# EAGLE design hand-made-board (EAGLE 9.5.2)
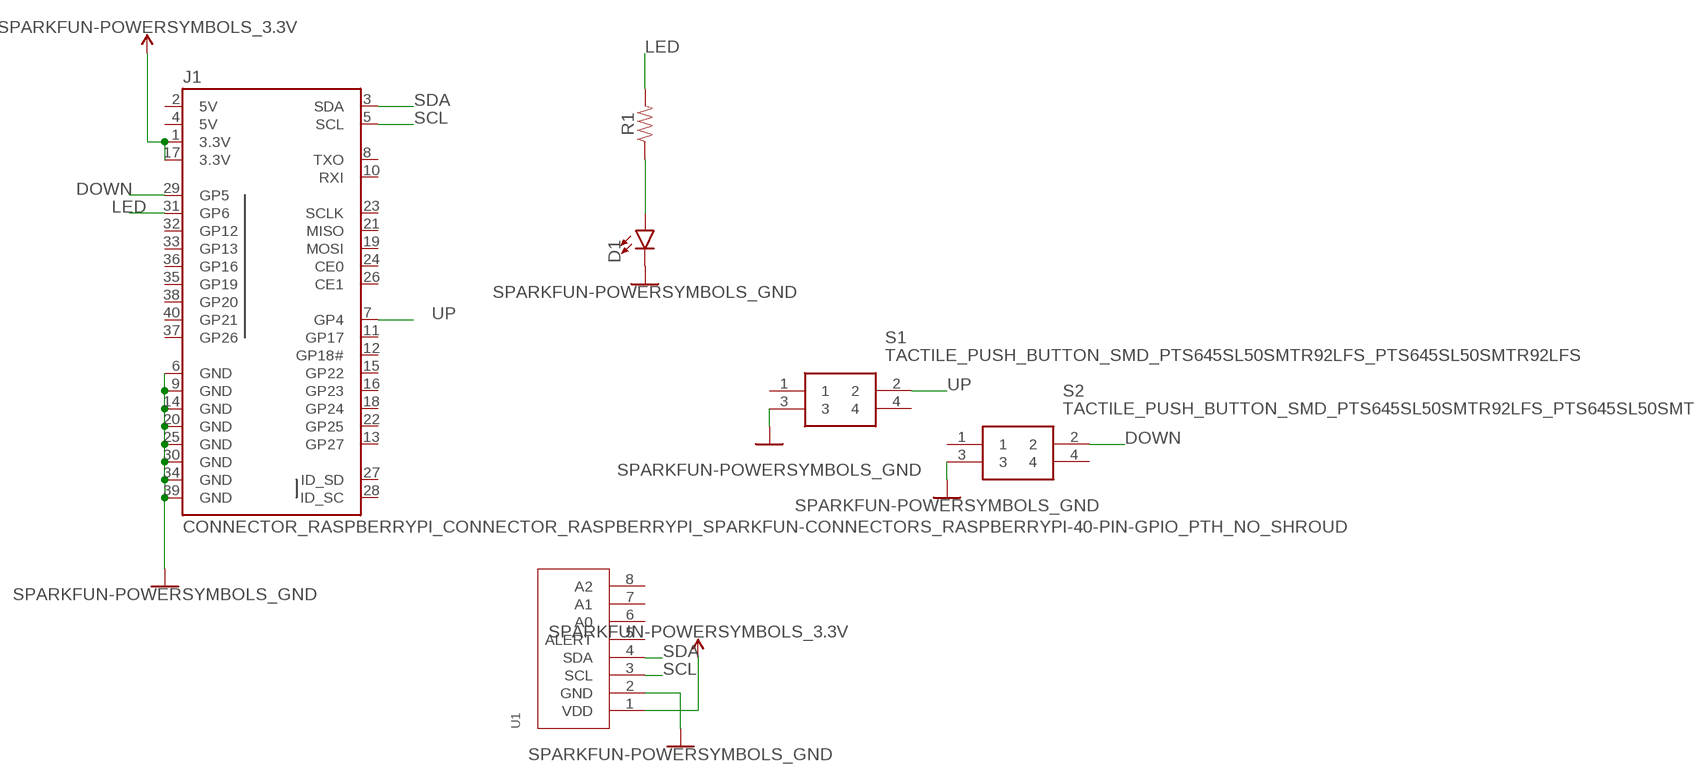
[diagram p0: schematic, sheet 1]

## Parts
D1  LED_SMD_SPARKFUN-LED_LED1206  [LED_SMD_SPARKFUN-LED_LED-1206]
J1  CONNECTOR_RASPBERRYPI_CONNECTOR_RASPBERRYPI_SPARKFUN-CONNECTORS_RASPBERRYPI-40-PIN-GPIO_PTH_NO_SHROUD  [CONNECTOR_RASPBERRYPI_CONNECTOR_RASPBERRYPI_SPARKFUN-CONNECTORS_2X20]
R1  LED_SMD_SPARKFUN-RESISTORS_RESISTOR1206  [LED_SMD_SPARKFUN-RESISTORS_1206]
S1  TACTILE_PUSH_BUTTON_SMD_PTS645SL50SMTR92LFS_PTS645SL50SMTR92LFS  [TACTILE_PUSH_BUTTON_SMD_PTS645SL50SMTR92LFS_PTS645SMT]
S2  TACTILE_PUSH_BUTTON_SMD_PTS645SL50SMTR92LFS_PTS645SL50SMTR92LFS  [TACTILE_PUSH_BUTTON_SMD_PTS645SL50SMTR92LFS_PTS645SMT]
U1  TEMPERATURE_SENSOR_MCP9808  [TEMPERATURE_SENSOR_MCP9808]

## Nets
3.3V: J1.1(3.3V) J1.17(3.3V) U1.1(VDD) ; supply symbol labelled SPARKFUN-POWERSYMBOLS_3.3V
DOWN: J1.29(GP5) S2.2
GND: D1.C J1.6(GND) J1.9(GND) J1.14(GND) J1.20(GND) J1.25(GND) J1.30(GND) J1.34(GND) J1.39(GND) S1.3 S2.3 U1.2(GND) ; supply symbol labelled SPARKFUN-POWERSYMBOLS_GND
LED: J1.31(GP6) R1.2
N$1: D1.A R1.1
SCL: J1.5(SCL) U1.3(SCL)
SDA: J1.3(SDA) U1.4(SDA)
UP: J1.7(GP4) S1.2
Unconnected: J1.8(TXO) J1.10(RXI) J1.11(GP17) J1.12(GP18#) J1.13(GP27) J1.15(GP22) J1.16(GP23) J1.18(GP24) J1.19(MOSI) J1.21(MISO) J1.22(GP25) J1.23(SCLK) J1.24(CE0) J1.26(CE1) J1.27(ID_SD) J1.28(ID_SC) J1.32(GP12) J1.33(GP13) J1.35(GP19) J1.36(GP16) J1.37(GP26) J1.38(GP20) J1.40(GP21) S1.1 S1.4 S2.1 S2.4 U1.5(ALERT) U1.6(A0) U1.7(A1) U1.8(A2)

## Power pins joined to a net without a drawn wire
5V: J1.2(5V) J1.4(5V)

## Library data of the parts
D1 = tempControllerParts:LED_SMD_SPARKFUN-LED_LED: LED (Generic) Standard schematic elements and footprints for 5mm, 3mm, 1206, and 0603 sized LEDs. Generic LEDs with no color specified.; PROD_ID: DIO-08794
J1 = tempControllerParts:CONNECTOR_RASPBERRYPI_CONNECTOR_RASPBERRYPI_SPARKFUN-CONNECTORS_RASPBERRYPI-40-PIN-GPIO: Raspberry Pi GPIO Header 2x20 pin connector, as found on B, B+, A+ models. Both shrouded PTH and SMT versions available. SparkFun Products: GPIO Shrouded Header <https://www.sparkfun.com/products/13054>- PTH SparkFun Pi Wedge (Preassembled) <https://www.sparkfun.com/products/13717>; PROD_ID: CONN-13143; SF_ID: PRT-13054
R1 = tempControllerParts:LED_SMD_SPARKFUN-RESISTORS_RESISTOR: Generic Resistor Package
S1 S2 = tempControllerParts:TACTILE_PUSH_BUTTON_SMD_PTS645SL50SMTR92LFS_PTS645SL50SMTR92LFS: PTS645SL50SMTR92LFS (Tactile Switches) Source: Datasheet <https://www.ckswitches.com/media/1471/pts645.pdf>; DESCRIPTION: PTS645SL50SMTR92LFS (Tactile Switches); HEIGHT: mm; MANUFACTURER_NAME: C & K COMPONENTS; MANUFACTURER_PART_NUMBER: PTS645SL50SMTR92LFS; MOUSER_PART_NUMBER: 611-PTS645SL50SMTR92; MOUSER_PRICE-STOCK: https://www.mouser.com/Search/Refine.aspx?Keyword=611-PTS645SL50SMTR92
U1 = tempControllerParts:TEMPERATURE_SENSOR_MCP9808

## Board
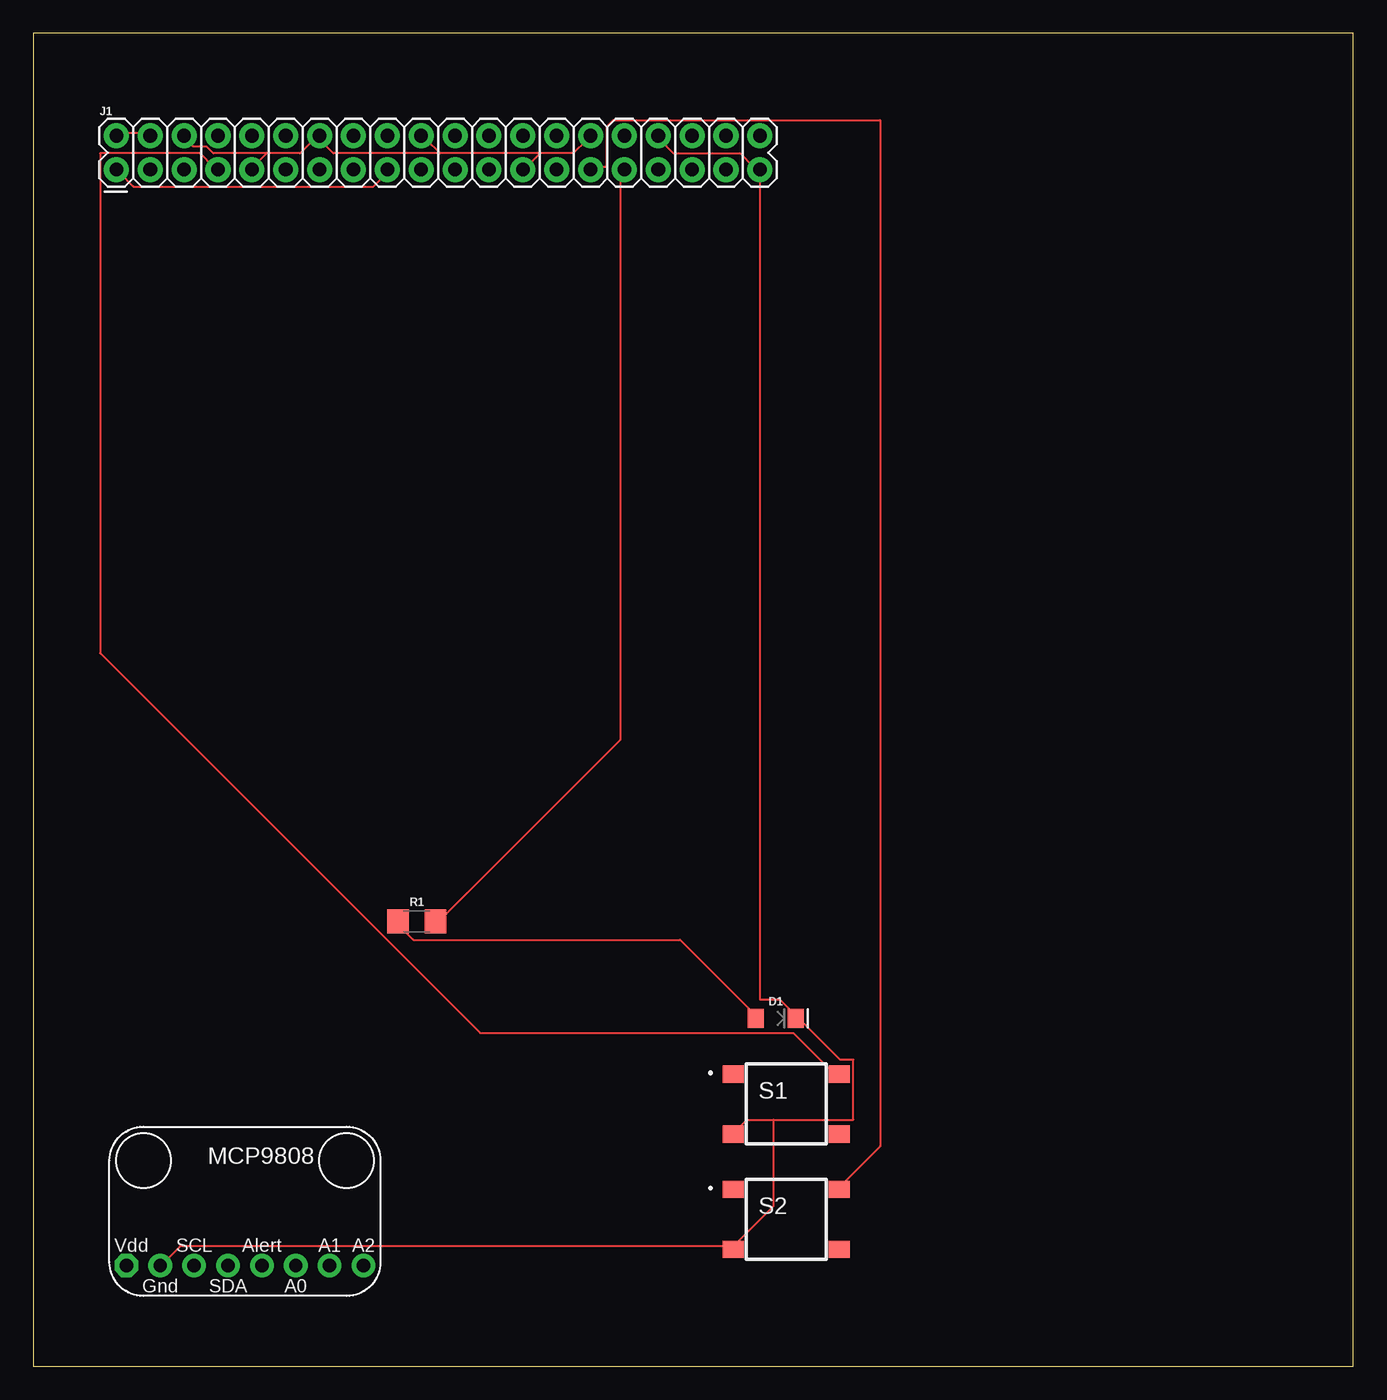
[diagram p1: board, top side]
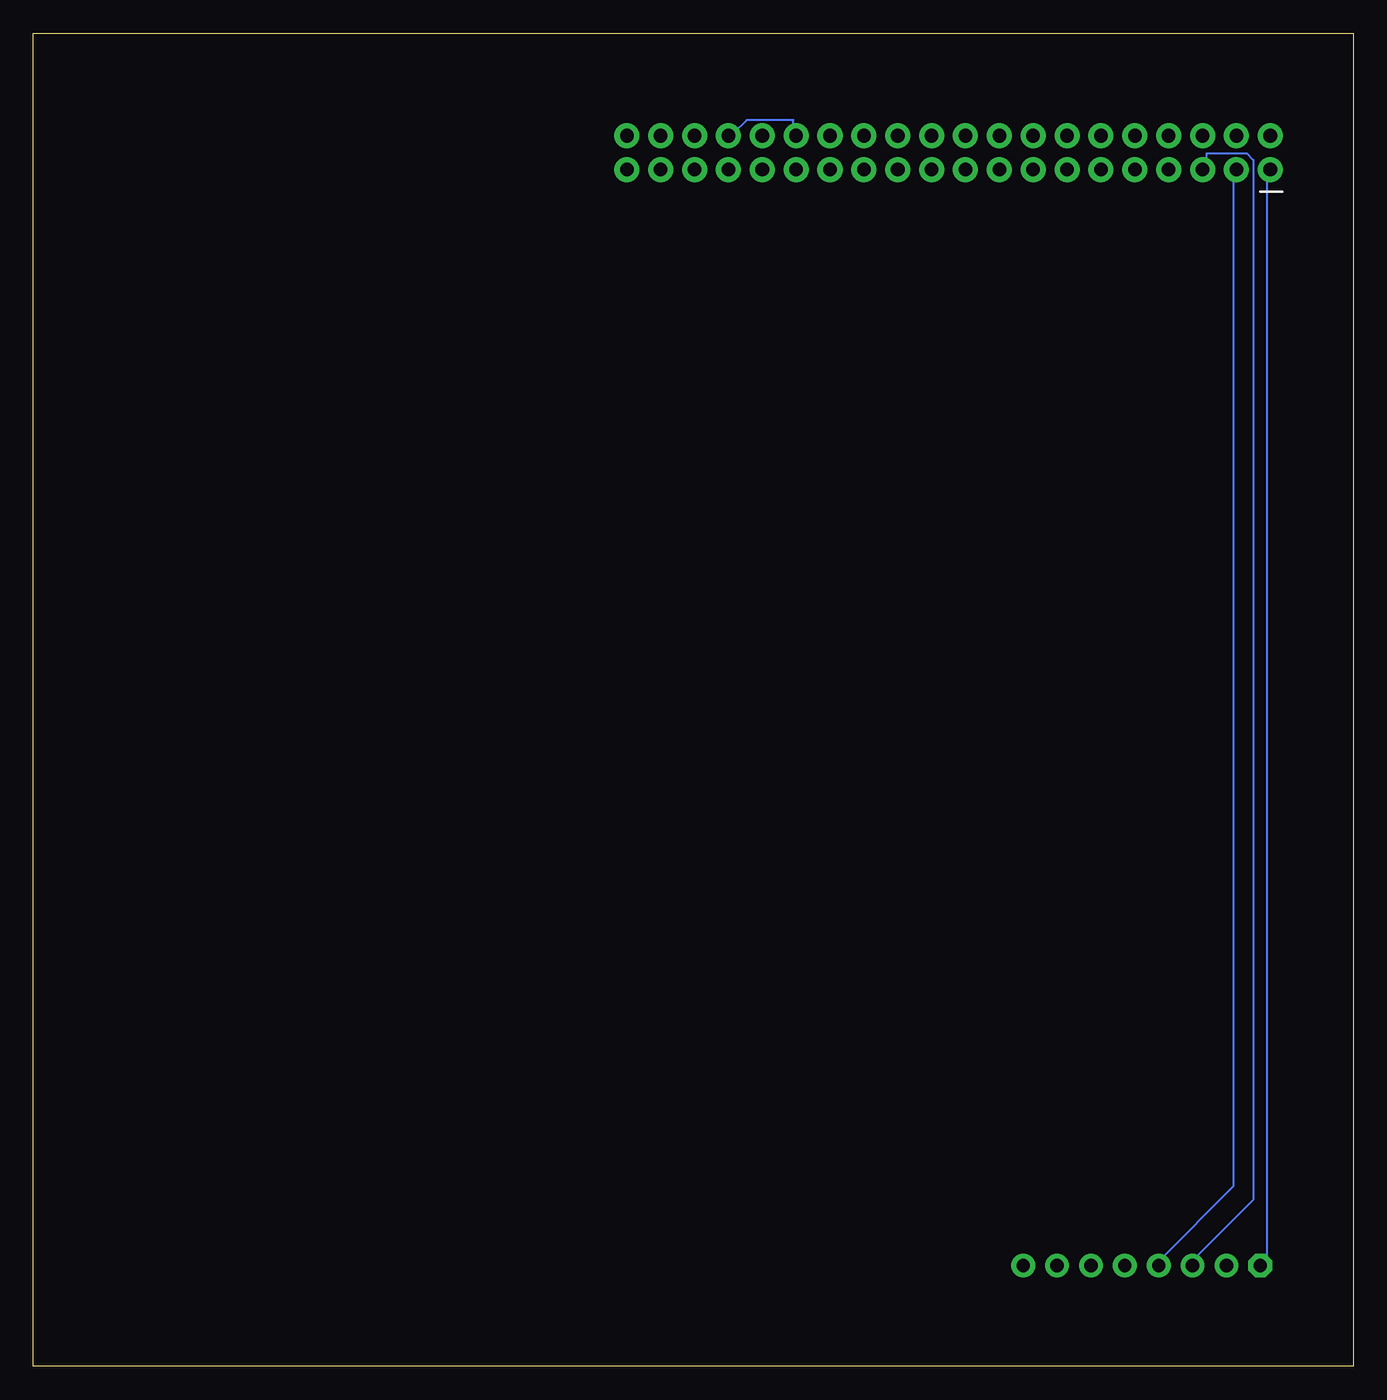
[diagram p2: board, bottom side, seen from below]

Size 99 x 100 mm. Coordinates in mm from the lower left corner, seen from the top.
Outline: 0,0 99,0 99,100 0,100 0,0
Copper layers (1*16): Top 0.035mm / dielectric 1.5mm / Bottom 0.035mm
Design rules "default": minimum track width 6mil, minimum drill 0.35mm, track to track 6mil, track to pad 6mil, pad to pad 6mil, via to via 6mil, smd to smd 6mil, copper to edge 40mil, drill to drill 6mil, minimum pad ring 10mil, minimum via ring 8mil, stop-mask expansion 4mil, vias tented up to drill 0mil, thermal gap 10mil

### Footprints (pad centres in the part's own frame; a part is rotated, then mirrored left to right if it is on the bottom)
LED_SMD_SPARKFUN-LED_LED-1206 = smd 1.2 x 1.4: A -1.5,0; C 1.5,0
CONNECTOR_RASPBERRYPI_CONNECTOR_RASPBERRYPI_SPARKFUN-CONNECTORS_2X20 = drill 1.016 pad 1.88: 1 -24.13,-1.27; 2 -24.13,1.27; 3 -21.59,-1.27; 4 -21.59,1.27; 5 -19.05,-1.27; 6 -19.05,1.27; 7 -16.51,-1.27; 8 -16.51,1.27; 9 -13.97,-1.27; 10 -13.97,1.27; 11 -11.43,-1.27; 12 -11.43,1.27; 13 -8.89,-1.27; 14 -8.89,1.27; 15 -6.35,-1.27; 16 -6.35,1.27; 17 -3.81,-1.27; 18 -3.81,1.27; 19 -1.27,-1.27; 20 -1.27,1.27; 21 1.27,-1.27; 22 1.27,1.27; 23 3.81,-1.27; 24 3.81,1.27; 25 6.35,-1.27; 26 6.35,1.27; 27 8.89,-1.27; 28 8.89,1.27; 29 11.43,-1.27; 30 11.43,1.27; 31 13.97,-1.27; 32 13.97,1.27; 33 16.51,-1.27; 34 16.51,1.27; 35 19.05,-1.27; 36 19.05,1.27; 37 21.59,-1.27; 38 21.59,1.27; 39 24.13,-1.27; 40 24.13,1.27
LED_SMD_SPARKFUN-RESISTORS_1206 = smd 1.6 x 1.8: 1 -1.4,0; 2 1.4,0
TACTILE_PUSH_BUTTON_SMD_PTS645SL50SMTR92LFS_PTS645SMT = smd 1.55 x 1.3: 1 -3.975,2.25; 2 3.975,2.25; 3 -3.975,-2.25; 4 3.975,-2.25
TEMPERATURE_SENSOR_MCP9808 = drill 1 pad 1.778 octagon: 1 -8.89,-4.064 | drill 1 pad 1.778: 2 -6.35,-4.064; 3 -3.81,-4.064; 4 -1.27,-4.064; 5 1.27,-4.064; 6 3.81,-4.064; 7 6.35,-4.064; 8 8.89,-4.064

### Placement (x,y rotation side)
D1  55.68,26.1 0 top
J1  30.36,91.05 0 top
R1  28.76,33.37 0 top
S1  56.47,19.67 0 top
S2  56.47,11.02 0 top
U1  15.87,11.62 0 top

### Tracks (layer width: path | path; a pad name or v marks a point on that pad's centre or on a via)
3.3V
  Top 0.152: J1.17 26.5,89.5 25.5,88.5 7.5,88.5 6.5,89.5 J1.1
  Bottom 0.152: U1.1 6.5,8 6.5,89.5 J1.1
5V
  Top 0.152: J1.2 6.5,92.5 8.5,92.5 J1.4
DOWN
  Top 0.152: S2.2 60.5,13.5 63.5,16.5 63.5,93.5 43.5,93.5 43,93 43,90 42,90 J1.29
GND
  Top 0.152: 17.5,91 16.5,90 J1.9 | 17.5,91 20,91 21,92 J1.14 21.5,92 22.5,91 30.5,91 | 17.5,91 13.5,91 13,91.5 12,91.5 11.5,92 J1.6 | 38,91 37,90 J1.25 | 38,91 40.5,91 41.5,92 J1.30 | 30.5,91 29.5,92 J1.20 | 38,91 30.5,91 | J1.34 47,92 48,91 53,91 54,90 J1.39 54.5,89.5 54.5,27.5 56,27.5 57,26.5 D1.C 57.5,26 60.5,23 61.5,23 61.5,18.5 55.5,18.5 | 55.5,18.5 53.5,18.5 52.5,17.5 S1.3 | 55.5,18.5 55.5,12 52.5,9 S2.3 52,9 11,9 10,8 U1.2
  Bottom 0.152: J1.34 46.5,92.5 45.5,93.5 42,93.5 42,92.5 J1.30
LED
  Top 0.152: R1.2 30.5,33.5 44,47 44,89.5 J1.31
N$1
  Top 0.152: D1.A 54,26.5 48.5,32 28.5,32 27.5,33 R1.1
SCL
  Bottom 0.152: U1.3 12,8 7.5,12.5 7.5,90.5 8,91 11,91 11,90 J1.5
SDA
  Bottom 0.152: U1.4 14.5,8 9,13.5 9,89.5 J1.3
UP
  Top 0.152: S1.2 60,22 57,25 33.5,25 5,53.5 5,91 12.5,91 13.5,90 J1.7